# EAGLE design ONOFF2 (EAGLE 9.5.2)
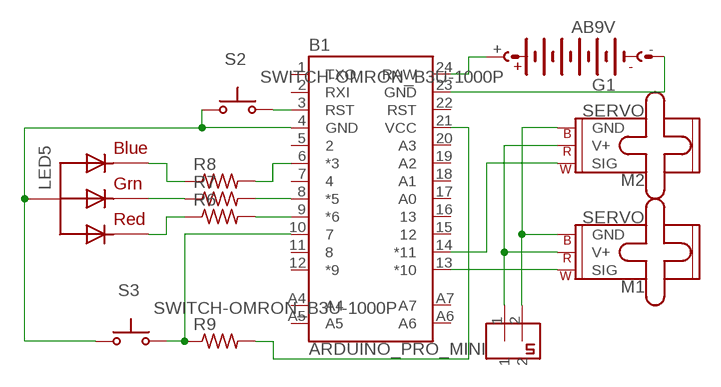
[diagram p0: schematic, sheet 1]

## Parts
B1  ARDUINO_PRO_MINI  [ARDUINO_PRO_MINI]
CONNECTOR1  2PIN  [2PIN]
G1  AB9V  [AB9V]
LED5  RGBLED_CA-5MM  [LED5MMRGB]
M1  SERVO  [1X03]
M2  SERVO  [1X03]
R6  R-US_AXIAL-7.2MM-PITCH  [RESAD724W46L381D178B]
R7  R-US_AXIAL-7.2MM-PITCH  [RESAD724W46L381D178B]
R8  R-US_AXIAL-7.2MM-PITCH  [RESAD724W46L381D178B]
R9  R-US_AXIAL-7.2MM-PITCH  [RESAD724W46L381D178B]
S2  SWITCH-OMRON_B3U-1000P  [SWITCH-OMRON_B3U-1000P]
S3  SWITCH-OMRON_B3U-1000P  [SWITCH-OMRON_B3U-1000P]

## Nets
N$2: B1.23(GND) G1.-
N$3: CONNECTOR1.2 M1.3(GND) M2.3(GND)
N$4: B1.4(GND) LED5.2(VCC) S2.1(P) S3.1(P)
N$5: CONNECTOR1.1 M1.2(V+) M2.2(V+)
N$6: B1.13(*10) M1.1(SIG)
N$7: B1.14(*11) M2.1(SIG)
N$8: LED5.4(BLUE) R8.1
N$9: LED5.3(GREEN) R7.1
N$10: LED5.1(RED) R6.1
N$11: B1.10 R9.1 S3.2(S)
N$12: B1.9(*6) R6.2
N$13: B1.8(*5) R7.2
N$14: B1.6(*3) R8.2
N$15: B1.3(RST) S2.2(S)
N$16: B1.21(VCC) R9.2
N$17: B1.24(RAW) G1.+
Unconnected: B1.1(TXO) B1.2(RXI) B1.5 B1.7 B1.11 B1.12(*9) B1.15 B1.16 B1.17(A0) B1.18(A1) B1.19(A2) B1.20(A3) B1.22(RST) B1.A4 B1.A5 B1.A6 B1.A7

## Library data of the parts
B1 = Arduino:ARDUINO_PRO_MINI: SparkFun Pro Mini Pro Mini compatible footprint. Dimensions: 0.7 x 1.3" PCB Thickness: 0.8mm SparkFun Products: 3.3V/8MHz <https://www.sparkfun.com/products/11114> 5V/16MHz <https://www.sparkfun.com/products/11113>
CONNECTOR1 = 2pin_small:2PIN: 2pin
G1 = battery:AB9V: 9-V BATTERY CLIP
LED5 = adafruit:RGBLED_CA: RGB LED, common-anode 5MM Staggered pins 5mm Piranha package http://www.ladyada.net/library/pcb/eaglelibrary.html
M1 M2 = SparkFun-Electromechanical:SERVO: Servo Motor 3-pin connector for a standard servo motor (voltage supply, ground, and control signal.) SparkFun Products Servo - Generic (Sub-Micro Size) <https://www.sparkfun.com/products/9065> (ROB-09065) Servo - Generic High Torque Continuous Rotation (Standard Size) <https://www.sparkfun.com/products/9347> (ROB-09347) Servo - Generic High Torque (Standard Size) <https://www.sparkfun.com/products/11965> (ROB-11965)
R6-R9 = Resistor:R-US: Resistor Fixed - ANSI; CATEGORY: Resistor; SUB-CATEGORY: Fixed
S2 S3 = 52101-101-REV-A:SWITCH-OMRON_B3U-1000P: SMD Tactile Switch - Ultra Small

## Board
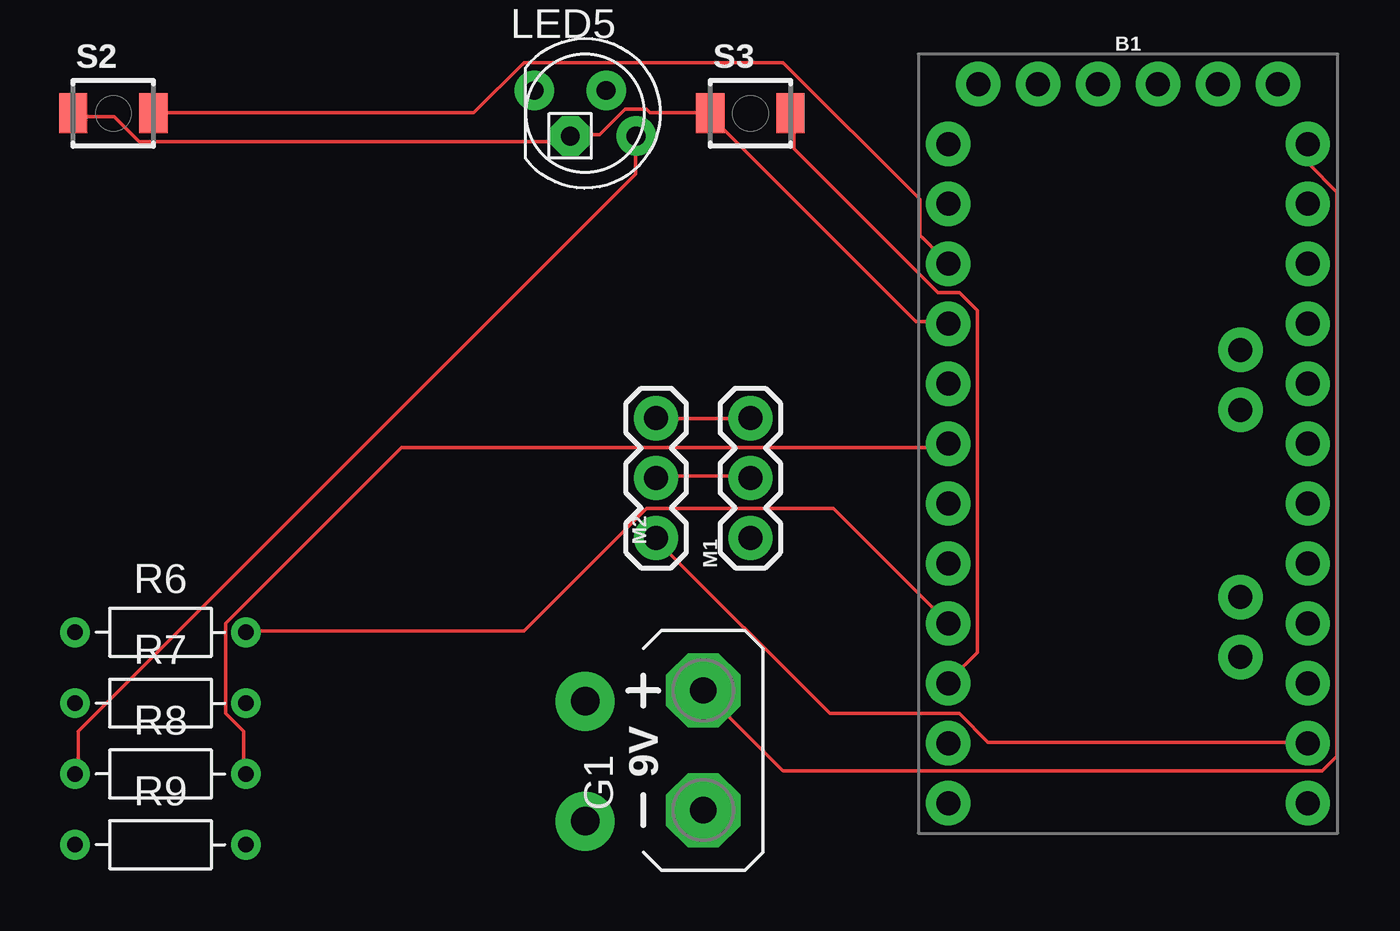
[diagram p1: board, top side]
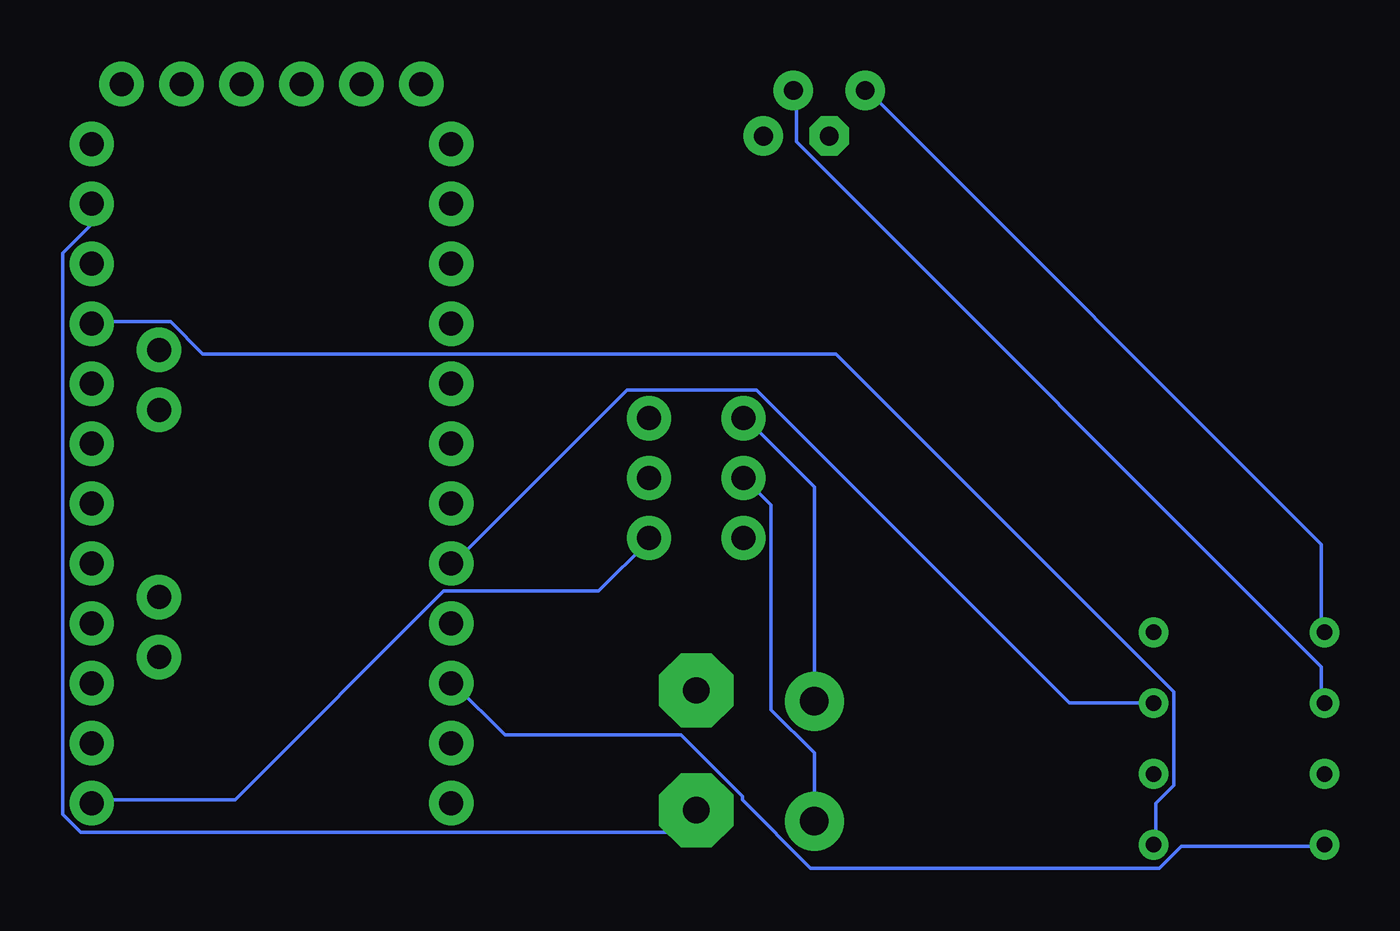
[diagram p2: board, bottom side, seen from below]

No outline drawn. Coordinates in mm, seen from the top.
Copper layers (1*16): Top 0.035mm / dielectric 1.5mm / Bottom 0.035mm
Design rules "default": minimum track width 6mil, minimum drill 0.35mm, track to track 6mil, track to pad 6mil, pad to pad 6mil, via to via 6mil, smd to smd 6mil, copper to edge 40mil, drill to drill 6mil, minimum pad ring 10mil, minimum via ring 8mil, stop-mask expansion 4mil, vias tented up to drill 0mil, thermal gap 10mil

### Footprints (pad centres in the part's own frame; a part is rotated, then mirrored left to right if it is on the bottom)
ARDUINO_PRO_MINI = drill 1.016 pad 1.88: 1 -7.62,12.7; 2 -7.62,10.16; 3 -7.62,7.62; 4 -7.62,5.08; 5 -7.62,2.54; 6 -7.62,0; 7 -7.62,-2.54; 8 -7.62,-5.08; 9 -7.62,-7.62; 10 -7.62,-10.16; 11 -7.62,-12.7; 12 -7.62,-15.24; 13 7.62,-15.24; 14 7.62,-12.7; 15 7.62,-10.16; 16 7.62,-7.62; 17 7.62,-5.08; 18 7.62,-2.54; 19 7.62,0; 20 7.62,2.54; 21 7.62,5.08; 22 7.62,7.62; 23 7.62,10.16; 24 7.62,12.7; A4 4.763,1.429; A5 4.763,3.969; A6 4.763,-9.049; A7 4.763,-6.509; BLK -6.35,15.24; GND -3.81,15.24; GRN 6.35,15.24; RXI 1.27,15.24; TXO 3.81,15.24; VCC -1.27,15.24
2PIN = drill 1.2 pad 2.5: 1 0,0; 2 5.08,0
AB9V = drill 1.118 pad 3.15 octagon: + 0,2.54; - 0,-2.54
LED5MMRGB = drill 0.8 pad 1.676: 1 -2.159,0.968; 3 0.889,0.968; 4 2.159,-0.968 | drill 0.8 pad 1.676 octagon: 2 -0.635,-0.968
1X03 = drill 1.016 pad 1.88: 1 0,0; 2 2.54,0; 3 5.08,0
RESAD724W46L381D178B = drill 0.66 pad 1.26: 1 -3.62,0; 2 3.62,0
SWITCH-OMRON_B3U-1000P = smd 1.2 x 1.7: 1 -1.7,0; 2 1.7,0

### Placement (x,y rotation side)
B1  -50,-48 0 top
CONNECTOR1  -73,-64 90 top
G1  -68,-61 0 top
LED5  -73,-34 0 top
M1  -66,-52 90 top
M2  -70,-52 90 top
R6  -91,-56 0 top
R7  -91,-59 0 top
R8  -91,-62 0 top
R9  -91,-65 0 top
S2  -93,-34 0 top
S3  -66,-34 0 top

### Tracks (layer width: path | path; a pad name or v marks a point on that pad's centre or on a via)
N$2
  Bottom 0.152: B1.23 -42.37,-37.95 -42.37,-38.71 -41.15,-39.93 -41.15,-63.7 -41.91,-64.47 -67.06,-64.47 -67.97,-63.55 G1.-
N$3
  Top 0.152: M2.3 -69.95,-46.94 -66.14,-46.94 M1.3
  Bottom 0.152: CONNECTOR1.2 -73,-58.83 -73,-49.84 -70.1,-46.94 M2.3
N$4
  Top 0.152: S2.1 -94.64,-34.14 -92.96,-34.14 -91.9,-35.2 -73.91,-35.2 -73.76,-35.05 LED5.2 -73.61,-34.9 -72.39,-34.9 -71.32,-33.83 -70.41,-33.83 -70.26,-33.98 -67.82,-33.98 S3.1 -67.67,-34.14 -58.98,-42.82 -57.76,-42.82 B1.4
N$5
  Top 0.152: M2.2 -69.95,-49.38 -66.14,-49.38 M1.2
  Bottom 0.152: CONNECTOR1.1 -73,-63.86 -73,-61.11 -71.17,-59.28 -71.17,-50.6 -70.1,-49.53 M2.2
N$6
  Bottom 0.152: B1.13 -42.52,-63.09 -48.46,-63.09 -57.3,-54.25 -63.86,-54.25 -65.99,-52.12 M1.1
N$7
  Top 0.152: B1.14 -42.52,-60.66 -55.93,-60.66 -57.15,-59.44 -62.64,-59.44 -69.95,-52.12 M2.1
N$8
  Top 0.152: R8.1 -94.49,-61.87 -94.49,-60.2 -70.87,-36.58 -70.87,-35.05 LED5.4
N$9
  Bottom 0.152: R7.1 -94.49,-58.98 -94.49,-57.45 -72.24,-35.2 -72.24,-33.07 LED5.3
N$10
  Bottom 0.152: R6.1 -94.49,-55.93 -94.49,-52.27 -75.29,-33.07 LED5.1
N$11
  Top 0.152: S3.2 -64.16,-34.14 -64.16,-35.51 -58.06,-41.6 -57.15,-41.6 -56.39,-42.37 -56.39,-56.84 -57.61,-58.06 B1.10
  Bottom 0.152: R9.1 -94.49,-65.08 -88.54,-65.08 -87.63,-65.99 -72.85,-65.99 -69.95,-63.09 -69.95,-62.94 -67.36,-60.35 -59.89,-60.35 -57.76,-58.22 B1.10
N$12
  Top 0.152: R6.2 -87.33,-55.93 -75.59,-55.93 -70.41,-50.75 -62.48,-50.75 -57.76,-55.47 B1.9
N$13
  Bottom 0.152: R7.2 -87.33,-58.98 -83.82,-58.98 -70.56,-45.72 -65.08,-45.72 -57.76,-53.03 B1.8
N$14
  Top 0.152: R8.2 -87.48,-61.87 -87.48,-60.2 -88.24,-59.44 -88.24,-55.63 -80.77,-48.16 -57.91,-48.16 -57.76,-48.01 B1.6
N$15
  Top 0.152: S2.2 -91.29,-33.98 -77.72,-33.98 -75.59,-31.85 -64.62,-31.85 -58.83,-37.64 -58.83,-39.17 -57.76,-40.23 B1.3
N$16
  Bottom 0.152: R9.2 -87.48,-64.92 -87.48,-63.25 -88.24,-62.48 -88.24,-58.52 -73.91,-44.2 -47.09,-44.2 -45.72,-42.82 -42.52,-42.82 B1.21
N$17
  Top 0.152: B1.24 -42.37,-35.36 -42.37,-36.12 -41.15,-37.34 -41.15,-61.27 -41.76,-61.87 -64.62,-61.87 -67.97,-58.52 G1.+